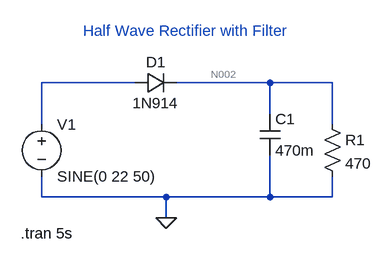
[diagram p0: schematic 3 Half Wave Rectifier.asc]
3 Half Wave Rectifier.asc, the LTspice schematic file:
Version 4
SHEET 1 880 680
WIRE 192 96 48 96
WIRE 400 96 256 96
WIRE 496 96 400 96
WIRE 400 144 400 96
WIRE 48 160 48 96
WIRE 496 160 496 96
WIRE 48 272 48 240
WIRE 240 272 48 272
WIRE 400 272 400 208
WIRE 400 272 240 272
WIRE 496 272 496 240
WIRE 496 272 400 272
WIRE 240 304 240 272
FLAG 240 304 0
SYMBOL voltage 48 144 R0
WINDOW 123 0 0 Left 0
WINDOW 39 0 0 Left 0
SYMATTR InstName V1
SYMATTR Value SINE(0 22 50)
SYMBOL diode 192 112 R270
WINDOW 0 32 32 VTop 2
WINDOW 3 0 32 VBottom 2
SYMATTR InstName D1
SYMATTR Value 1N914
SYMBOL res 480 144 R0
SYMATTR InstName R1
SYMATTR Value 470
SYMBOL cap 384 144 R0
SYMATTR InstName C1
SYMATTR Value 470m
TEXT 16 328 Left 2 !.tran 5s
TEXT 112 16 Left 2 ;Half Wave Rectifier with Filter

The netlist it stands for:
* 3 Half Wave Rectifier.asc
V1 N001 0 SINE(0 22 50)
D1 N001 N002 1N914
R1 N002 0 470
C1 N002 0 470m
.model D D
.lib standard.dio
.tran 5s
* Half Wave Rectifier with Filter
.backanno
.end

* Results of the author's LTspice run, read from the files saved beside the schematic
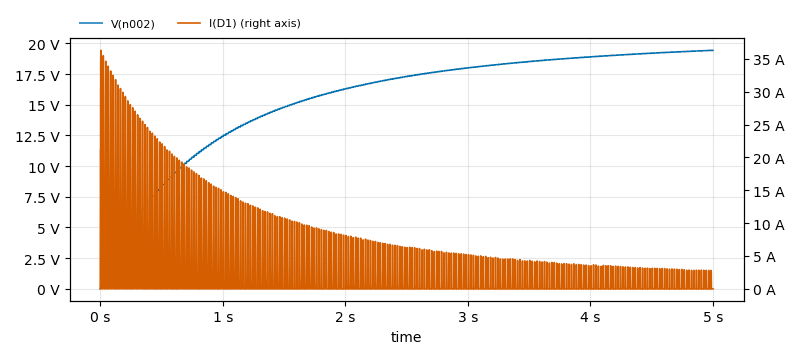
[diagram p1: Transient Analysis of 3 Half Wave Rectifier.asc, plotted from the saved traces]
* Transient Analysis, 1 run:
*   V(n002): min 0 V, max 19.44 V, average 15.46 V, rms 16.1 V, last 19.44 V
*   I(D1): min 0 A, max 36.3 A, average 1.849 A, rms 5.306 A, last 0 A